# Altium schematic sheet GPIO_EXPANDER_LED.SchDoc: My title
size A3; Organization: University of California; Address1: 475 Portola Plaza; Address2: Los Angeles, CA 90095; Revision: R01; SheetNumber: 1; SheetTotal: 1
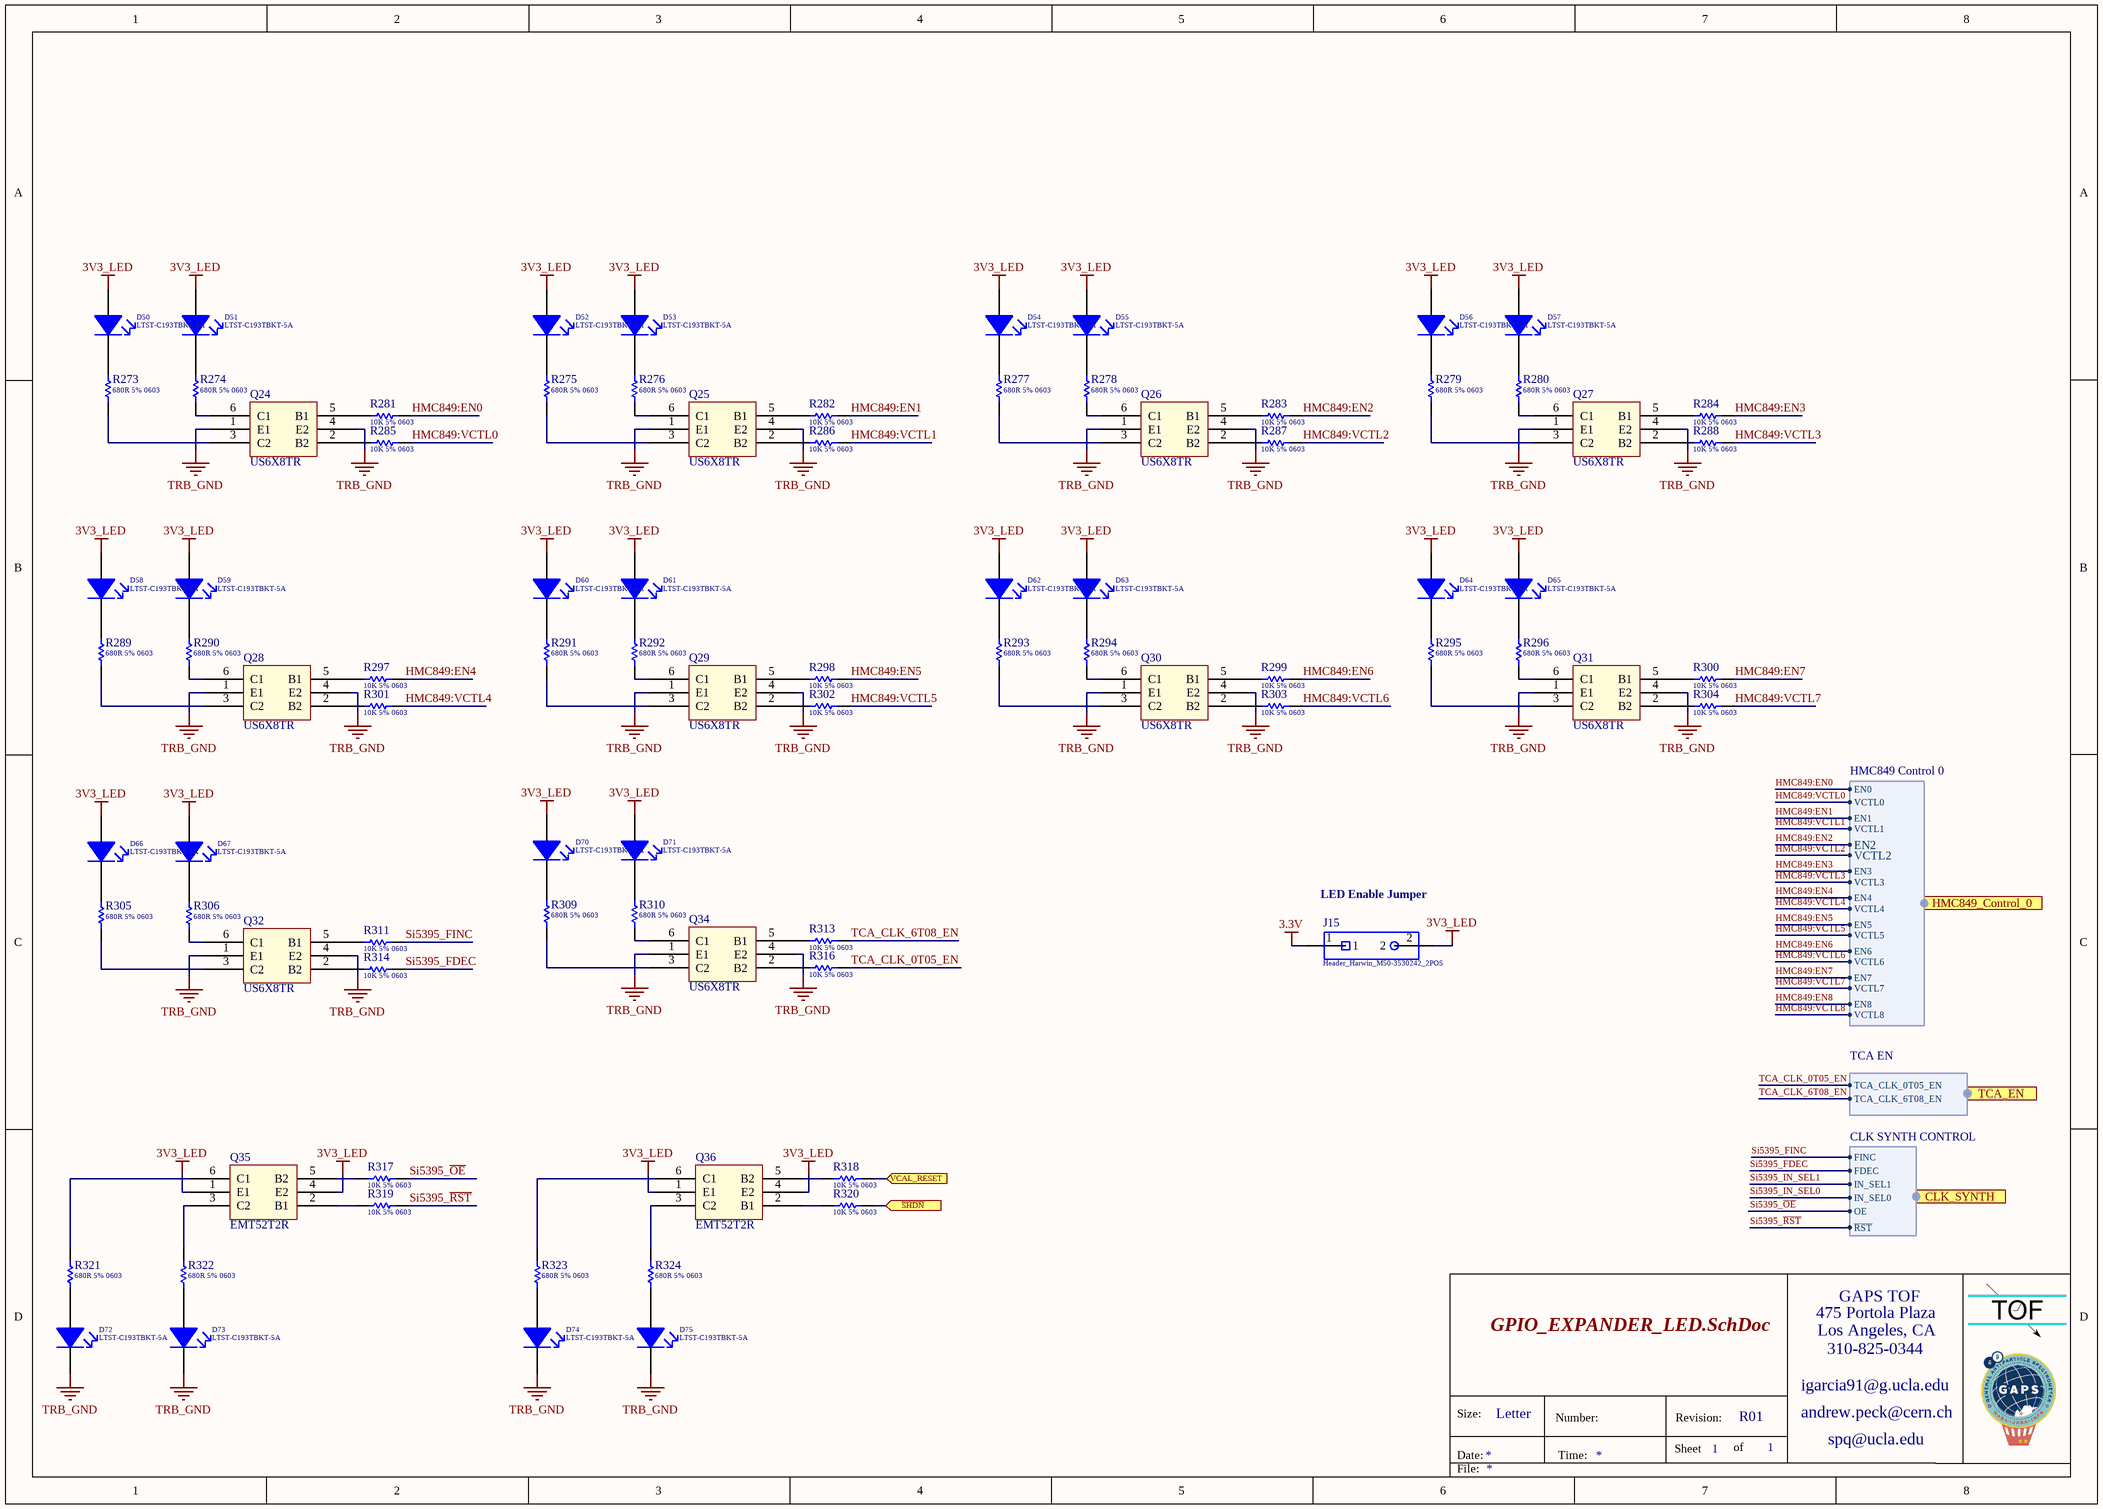
[diagram p0: GPIO_EXPANDER_LED.SchDoc]

## Parts
D50  Series: LTST-C193TBKT-5A  [Led_Lite-On_LTST-C193TBKT-5A_Blue]  (hidden comment: Led_Lite-On_LTST-C193TBKT-5A_Blue)
D51  Series: LTST-C193TBKT-5A  [Led_Lite-On_LTST-C193TBKT-5A_Blue]  (hidden comment: Led_Lite-On_LTST-C193TBKT-5A_Blue)
D52  Series: LTST-C193TBKT-5A  [Led_Lite-On_LTST-C193TBKT-5A_Blue]  (hidden comment: Led_Lite-On_LTST-C193TBKT-5A_Blue)
D53  Series: LTST-C193TBKT-5A  [Led_Lite-On_LTST-C193TBKT-5A_Blue]  (hidden comment: Led_Lite-On_LTST-C193TBKT-5A_Blue)
D54  Series: LTST-C193TBKT-5A  [Led_Lite-On_LTST-C193TBKT-5A_Blue]  (hidden comment: Led_Lite-On_LTST-C193TBKT-5A_Blue)
D55  Series: LTST-C193TBKT-5A  [Led_Lite-On_LTST-C193TBKT-5A_Blue]  (hidden comment: Led_Lite-On_LTST-C193TBKT-5A_Blue)
D56  Series: LTST-C193TBKT-5A  [Led_Lite-On_LTST-C193TBKT-5A_Blue]  (hidden comment: Led_Lite-On_LTST-C193TBKT-5A_Blue)
D57  Series: LTST-C193TBKT-5A  [Led_Lite-On_LTST-C193TBKT-5A_Blue]  (hidden comment: Led_Lite-On_LTST-C193TBKT-5A_Blue)
D58  Series: LTST-C193TBKT-5A  [Led_Lite-On_LTST-C193TBKT-5A_Blue]  (hidden comment: Led_Lite-On_LTST-C193TBKT-5A_Blue)
D59  Series: LTST-C193TBKT-5A  [Led_Lite-On_LTST-C193TBKT-5A_Blue]  (hidden comment: Led_Lite-On_LTST-C193TBKT-5A_Blue)
D60  Series: LTST-C193TBKT-5A  [Led_Lite-On_LTST-C193TBKT-5A_Blue]  (hidden comment: Led_Lite-On_LTST-C193TBKT-5A_Blue)
D61  Series: LTST-C193TBKT-5A  [Led_Lite-On_LTST-C193TBKT-5A_Blue]  (hidden comment: Led_Lite-On_LTST-C193TBKT-5A_Blue)
D62  Series: LTST-C193TBKT-5A  [Led_Lite-On_LTST-C193TBKT-5A_Blue]  (hidden comment: Led_Lite-On_LTST-C193TBKT-5A_Blue)
D63  Series: LTST-C193TBKT-5A  [Led_Lite-On_LTST-C193TBKT-5A_Blue]  (hidden comment: Led_Lite-On_LTST-C193TBKT-5A_Blue)
D64  Series: LTST-C193TBKT-5A  [Led_Lite-On_LTST-C193TBKT-5A_Blue]  (hidden comment: Led_Lite-On_LTST-C193TBKT-5A_Blue)
D65  Series: LTST-C193TBKT-5A  [Led_Lite-On_LTST-C193TBKT-5A_Blue]  (hidden comment: Led_Lite-On_LTST-C193TBKT-5A_Blue)
D66  Series: LTST-C193TBKT-5A  [Led_Lite-On_LTST-C193TBKT-5A_Blue]  (hidden comment: Led_Lite-On_LTST-C193TBKT-5A_Blue)
D67  Series: LTST-C193TBKT-5A  [Led_Lite-On_LTST-C193TBKT-5A_Blue]  (hidden comment: Led_Lite-On_LTST-C193TBKT-5A_Blue)
D70  Series: LTST-C193TBKT-5A  [Led_Lite-On_LTST-C193TBKT-5A_Blue]  (hidden comment: Led_Lite-On_LTST-C193TBKT-5A_Blue)
D71  Series: LTST-C193TBKT-5A  [Led_Lite-On_LTST-C193TBKT-5A_Blue]  (hidden comment: Led_Lite-On_LTST-C193TBKT-5A_Blue)
D72  Series: LTST-C193TBKT-5A  [Led_Lite-On_LTST-C193TBKT-5A_Blue]  (hidden comment: Led_Lite-On_LTST-C193TBKT-5A_Blue)
D73  Series: LTST-C193TBKT-5A  [Led_Lite-On_LTST-C193TBKT-5A_Blue]  (hidden comment: Led_Lite-On_LTST-C193TBKT-5A_Blue)
D74  Series: LTST-C193TBKT-5A  [Led_Lite-On_LTST-C193TBKT-5A_Blue]  (hidden comment: Led_Lite-On_LTST-C193TBKT-5A_Blue)
D75  Series: LTST-C193TBKT-5A  [Led_Lite-On_LTST-C193TBKT-5A_Blue]  (hidden comment: Led_Lite-On_LTST-C193TBKT-5A_Blue)
J15  Header_Harwin_M50-3530242_2POS  [Header_Harwin_M50-3530242_2POS]
Q24  Series: US6X8TR  [BJT_ROHM_US6X8TR_1A_NPN]  (hidden comment: BJT_ROHM_US6X8TR_1A_NPN)
Q25  Series: US6X8TR  [BJT_ROHM_US6X8TR_1A_NPN]  (hidden comment: BJT_ROHM_US6X8TR_1A_NPN)
Q26  Series: US6X8TR  [BJT_ROHM_US6X8TR_1A_NPN]  (hidden comment: BJT_ROHM_US6X8TR_1A_NPN)
Q27  Series: US6X8TR  [BJT_ROHM_US6X8TR_1A_NPN]  (hidden comment: BJT_ROHM_US6X8TR_1A_NPN)
Q28  Series: US6X8TR  [BJT_ROHM_US6X8TR_1A_NPN]  (hidden comment: BJT_ROHM_US6X8TR_1A_NPN)
Q29  Series: US6X8TR  [BJT_ROHM_US6X8TR_1A_NPN]  (hidden comment: BJT_ROHM_US6X8TR_1A_NPN)
Q30  Series: US6X8TR  [BJT_ROHM_US6X8TR_1A_NPN]  (hidden comment: BJT_ROHM_US6X8TR_1A_NPN)
Q31  Series: US6X8TR  [BJT_ROHM_US6X8TR_1A_NPN]  (hidden comment: BJT_ROHM_US6X8TR_1A_NPN)
Q32  Series: US6X8TR  [BJT_ROHM_US6X8TR_1A_NPN]  (hidden comment: BJT_ROHM_US6X8TR_1A_NPN)
Q34  Series: US6X8TR  [BJT_ROHM_US6X8TR_1A_NPN]  (hidden comment: BJT_ROHM_US6X8TR_1A_NPN)
Q35  Series: EMT52T2R  [BJT_ROHM_EMT52T2R_100mA_PNP]  (hidden comment: BJT_ROHM_EMT52T2R_100mA_PNP)
Q36  Series: EMT52T2R  [BJT_ROHM_EMT52T2R_100mA_PNP]  (hidden comment: BJT_ROHM_EMT52T2R_100mA_PNP)
R273  680R 5% 0603  [RESC0603(1608)_L]
R274  680R 5% 0603  [RESC0603(1608)_L]
R275  680R 5% 0603  [RESC0603(1608)_L]
R276  680R 5% 0603  [RESC0603(1608)_L]
R277  680R 5% 0603  [RESC0603(1608)_L]
R278  680R 5% 0603  [RESC0603(1608)_L]
R279  680R 5% 0603  [RESC0603(1608)_L]
R280  680R 5% 0603  [RESC0603(1608)_L]
R281  10K 5% 0603  [RESC0603(1608)_L]
R282  10K 5% 0603  [RESC0603(1608)_L]
R283  10K 5% 0603  [RESC0603(1608)_L]
R284  10K 5% 0603  [RESC0603(1608)_L]
R285  10K 5% 0603  [RESC0603(1608)_L]
R286  10K 5% 0603  [RESC0603(1608)_L]
R287  10K 5% 0603  [RESC0603(1608)_L]
R288  10K 5% 0603  [RESC0603(1608)_L]
R289  680R 5% 0603  [RESC0603(1608)_L]
R290  680R 5% 0603  [RESC0603(1608)_L]
R291  680R 5% 0603  [RESC0603(1608)_L]
R292  680R 5% 0603  [RESC0603(1608)_L]
R293  680R 5% 0603  [RESC0603(1608)_L]
R294  680R 5% 0603  [RESC0603(1608)_L]
R295  680R 5% 0603  [RESC0603(1608)_L]
R296  680R 5% 0603  [RESC0603(1608)_L]
R297  10K 5% 0603  [RESC0603(1608)_L]
R298  10K 5% 0603  [RESC0603(1608)_L]
R299  10K 5% 0603  [RESC0603(1608)_L]
R300  10K 5% 0603  [RESC0603(1608)_L]
R301  10K 5% 0603  [RESC0603(1608)_L]
R302  10K 5% 0603  [RESC0603(1608)_L]
R303  10K 5% 0603  [RESC0603(1608)_L]
R304  10K 5% 0603  [RESC0603(1608)_L]
R305  680R 5% 0603  [RESC0603(1608)_L]
R306  680R 5% 0603  [RESC0603(1608)_L]
R309  680R 5% 0603  [RESC0603(1608)_L]
R310  680R 5% 0603  [RESC0603(1608)_L]
R311  10K 5% 0603  [RESC0603(1608)_L]
R313  10K 5% 0603  [RESC0603(1608)_L]
R314  10K 5% 0603  [RESC0603(1608)_L]
R316  10K 5% 0603  [RESC0603(1608)_L]
R317  10K 5% 0603  [RESC0603(1608)_L]
R318  10K 5% 0603  [RESC0603(1608)_L]
R319  10K 5% 0603  [RESC0603(1608)_L]
R320  10K 5% 0603  [RESC0603(1608)_L]
R321  680R 5% 0603  [RESC0603(1608)_L]
R322  680R 5% 0603  [RESC0603(1608)_L]
R323  680R 5% 0603  [RESC0603(1608)_L]
R324  680R 5% 0603  [RESC0603(1608)_L]

## Ports
CLK_SYNTH (harness CLK SYNTH CONTROL), HMC849_Control_0 (harness HMC849 Control 0), TCA_EN (harness TCA EN), VCAL_RESET (in), ~{SHDN} (in)

## Harnesses
HMC849 Control 0: EN0, VCTL0, EN1, VCTL1, EN2, VCTL2, EN3, VCTL3, EN4, VCTL4, EN5, VCTL5, EN6, VCTL6, EN7, VCTL7, EN8, VCTL8
TCA EN: TCA_CLK_0T05_EN, TCA_CLK_6T08_EN
CLK SYNTH CONTROL: ~{RST}, OE, IN_SEL0, IN_SEL1, FDEC, FINC

## Nets
3.3V: J15.1
3V3_LED: D50.2(A) D51.2(A) D52.2(A) D53.2(A) D54.2(A) D55.2(A) D56.2(A) D57.2(A) D58.2(A) D59.2(A) D60.2(A) D61.2(A) D62.2(A) D63.2(A) D64.2(A) D65.2(A) D66.2(A) D67.2(A) D70.2(A) D71.2(A) J15.2 Q35.1(E1) Q35.4(E2) Q36.1(E1) Q36.4(E2)
TRB_GND: D72.1(K) D73.1(K) D74.1(K) D75.1(K) Q24.1(E1) Q24.4(E2) Q25.1(E1) Q25.4(E2) Q26.1(E1) Q26.4(E2) Q27.1(E1) Q27.4(E2) Q28.1(E1) Q28.4(E2) Q29.1(E1) Q29.4(E2) Q30.1(E1) Q30.4(E2) Q31.1(E1) Q31.4(E2) Q32.1(E1) Q32.4(E2) Q34.1(E1) Q34.4(E2)
HMC849:EN0: R281.2 ; port HMC849_Control_0.EN0
HMC849:EN1: R282.2 ; port HMC849_Control_0.EN1
HMC849:EN2: R283.2 ; port HMC849_Control_0.EN2
HMC849:EN3: R284.2 ; port HMC849_Control_0.EN3
HMC849:EN4: R297.2 ; port HMC849_Control_0.EN4
HMC849:EN5: R298.2 ; port HMC849_Control_0.EN5
HMC849:EN6: R299.2 ; port HMC849_Control_0.EN6
HMC849:EN7: R300.2 ; port HMC849_Control_0.EN7
HMC849:EN8: port HMC849_Control_0.EN8
HMC849:VCTL0: R285.1 ; port HMC849_Control_0.VCTL0
HMC849:VCTL1: R286.1 ; port HMC849_Control_0.VCTL1
HMC849:VCTL2: R287.1 ; port HMC849_Control_0.VCTL2
HMC849:VCTL3: R288.1 ; port HMC849_Control_0.VCTL3
HMC849:VCTL4: R301.1 ; port HMC849_Control_0.VCTL4
HMC849:VCTL5: R302.1 ; port HMC849_Control_0.VCTL5
HMC849:VCTL6: R303.1 ; port HMC849_Control_0.VCTL6
HMC849:VCTL7: R304.1 ; port HMC849_Control_0.VCTL7
HMC849:VCTL8: port HMC849_Control_0.VCTL8
~{SHDN}: R320.2 ; port ~{SHDN}
Si5395_FDEC: R314.1 ; port CLK_SYNTH.FDEC
Si5395_FINC: R311.2 ; port CLK_SYNTH.FINC
Si5395_IN_SEL0: port CLK_SYNTH.IN_SEL0
Si5395_IN_SEL1: port CLK_SYNTH.IN_SEL1
Si5395_~{OE}: R317.1 ; port CLK_SYNTH.OE
Si5395_~{RST}: R319.2 ; port CLK_SYNTH.~{RST}
TCA_CLK_0T05_EN: R316.1 ; port TCA_EN.TCA_CLK_0T05_EN
TCA_CLK_6T08_EN: R313.2 ; port TCA_EN.TCA_CLK_6T08_EN
VCAL_RESET: R318.1 ; port VCAL_RESET
NetD50_1: D50.1(K) R273.2
NetD51_1: D51.1(K) R274.2
NetD52_1: D52.1(K) R275.2
NetD53_1: D53.1(K) R276.2
NetD54_1: D54.1(K) R277.2
NetD55_1: D55.1(K) R278.2
NetD56_1: D56.1(K) R279.2
NetD57_1: D57.1(K) R280.2
NetD58_1: D58.1(K) R289.2
NetD59_1: D59.1(K) R290.2
NetD60_1: D60.1(K) R291.2
NetD61_1: D61.1(K) R292.2
NetD62_1: D62.1(K) R293.2
NetD63_1: D63.1(K) R294.2
NetD64_1: D64.1(K) R295.2
NetD65_1: D65.1(K) R296.2
NetD66_1: D66.1(K) R305.2
NetD67_1: D67.1(K) R306.2
NetD70_1: D70.1(K) R309.2
NetD71_1: D71.1(K) R310.2
NetD72_2: D72.2(A) R321.1
NetD73_2: D73.2(A) R322.1
NetD74_2: D74.2(A) R323.1
NetD75_2: D75.2(A) R324.1
NetQ24_2: Q24.2(B2) R285.2
NetQ24_3: Q24.3(C2) R273.1
NetQ24_5: Q24.5(B1) R281.1
NetQ24_6: Q24.6(C1) R274.1
NetQ25_2: Q25.2(B2) R286.2
NetQ25_3: Q25.3(C2) R275.1
NetQ25_5: Q25.5(B1) R282.1
NetQ25_6: Q25.6(C1) R276.1
NetQ26_2: Q26.2(B2) R287.2
NetQ26_3: Q26.3(C2) R277.1
NetQ26_5: Q26.5(B1) R283.1
NetQ26_6: Q26.6(C1) R278.1
NetQ27_2: Q27.2(B2) R288.2
NetQ27_3: Q27.3(C2) R279.1
NetQ27_5: Q27.5(B1) R284.1
NetQ27_6: Q27.6(C1) R280.1
NetQ28_2: Q28.2(B2) R301.2
NetQ28_3: Q28.3(C2) R289.1
NetQ28_5: Q28.5(B1) R297.1
NetQ28_6: Q28.6(C1) R290.1
NetQ29_2: Q29.2(B2) R302.2
NetQ29_3: Q29.3(C2) R291.1
NetQ29_5: Q29.5(B1) R298.1
NetQ29_6: Q29.6(C1) R292.1
NetQ30_2: Q30.2(B2) R303.2
NetQ30_3: Q30.3(C2) R293.1
NetQ30_5: Q30.5(B1) R299.1
NetQ30_6: Q30.6(C1) R294.1
NetQ31_2: Q31.2(B2) R304.2
NetQ31_3: Q31.3(C2) R295.1
NetQ31_5: Q31.5(B1) R300.1
NetQ31_6: Q31.6(C1) R296.1
NetQ32_2: Q32.2(B2) R314.2
NetQ32_3: Q32.3(C2) R305.1
NetQ32_5: Q32.5(B1) R311.1
NetQ32_6: Q32.6(C1) R306.1
NetQ34_2: Q34.2(B2) R316.2
NetQ34_3: Q34.3(C2) R309.1
NetQ34_5: Q34.5(B1) R313.1
NetQ34_6: Q34.6(C1) R310.1
NetQ35_2: Q35.2(B1) R319.1
NetQ35_3: Q35.3(C2) R322.2
NetQ35_5: Q35.5(B2) R317.2
NetQ35_6: Q35.6(C1) R321.2
NetQ36_2: Q36.2(B1) R320.1
NetQ36_3: Q36.3(C2) R324.2
NetQ36_5: Q36.5(B2) R318.2
NetQ36_6: Q36.6(C1) R323.2

## Notes on the sheet
- (near J15) LED Enable Jumper
- 475 Portola Plaza
- GAPS TOF
- igarcia91@g.ucla.edu
- Los Angeles, CA
- 310-825-0344
- Size:
- Date:
- Letter
- Number:
- Time:
- Sheet
- Revision:
- of
- andrew.peck@cern.ch
- spq@ucla.edu
- File:

## Library data of the parts
D50-D67 D70-D75 = Led_Lite-On_LTST-C193TBKT-5A_Blue: Standard LEDs - SMD Blue 470nm 28mcd 20mA; Supplier 1: Mouser; Supplier Part Number 1: 859-LTSTC193TBKT5A
J15 = Header_Harwin_M50-3530242_2POS: Headers & Wire Housings 2 WAY SIL VERT PC TAIL P/HDR; Supplier 1: Mouser; Supplier Part Number 1: 855-M50-3530242
Q24-Q32 Q34 = BJT_ROHM_US6X8TR_1A_NPN: Bipolar Transistors - BJT NPN+NPN 30VCEO 1A SOT-363T; Supplier Part Number 1: 755-US6X8TR; Supplier 1: Mouser
Q35 Q36 = BJT_ROHM_EMT52T2R_100mA_PNP: Bipolar Transistors - BJT Bipolar Transistor SOT-563 SC-107C EMT6; Supplier 1: Mouser; Supplier Part Number 1: 755-EMT52T2R
R273-R280 R289-R296 R305 R306 R309 R310 R321-R324 = CMP-1012-00070-1: 680R 0.1W 5% 0603 (1608 Metric)  SMD; Case-EIA: 0603; Value: 680.00 Ohm; Case-Metric: 1608; Tolerance: 5 %; Technology: SMT; Power: 0.1 W
R281-R288 R297-R304 R311 R313 R314 R316-R320 = CMP-1012-00098-1: 10K 0.1W 5% 0603 (1608 Metric)  SMD; Case-EIA: 0603; Value: 10000.00 Ohm; Case-Metric: 1608; Technology: SMT; Tolerance: 5 %; Power: 0.1 W